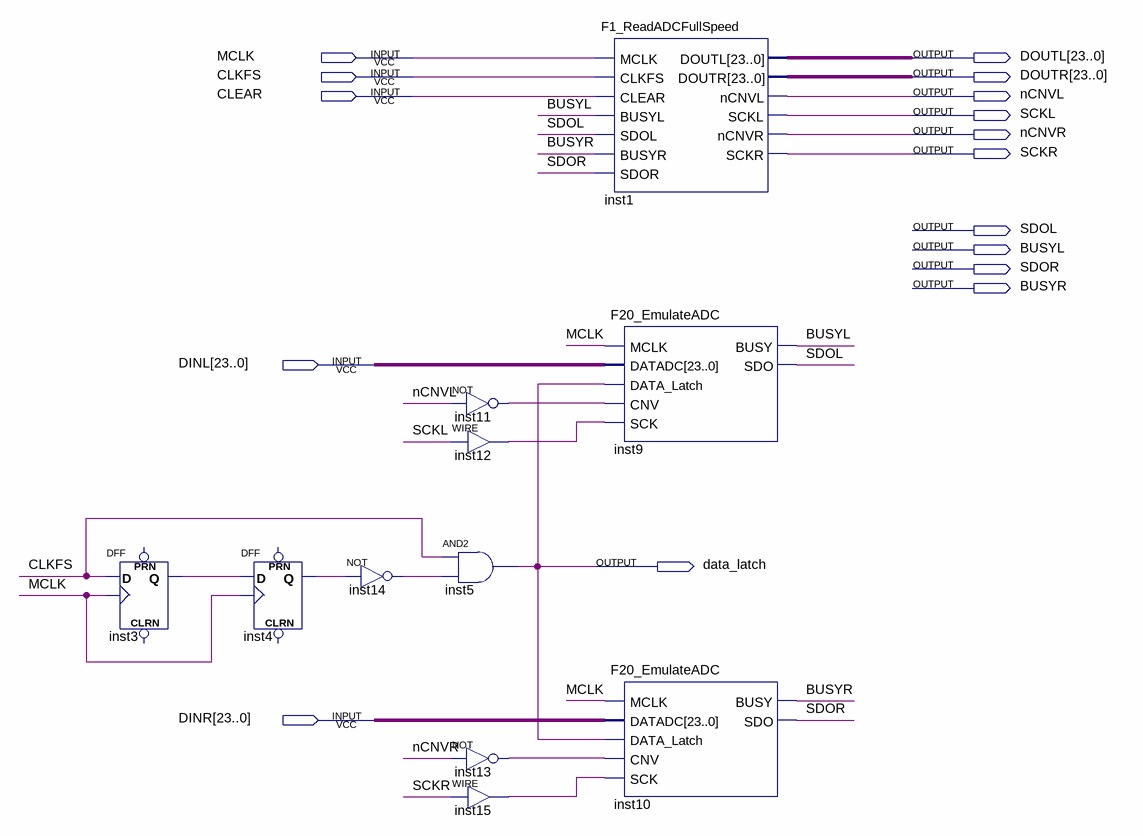
[diagram p0: schematic sheet]
// Quartus schematic TEST_ReadADCfullspeed.bdf as structural Verilog: 11 symbols, 16 pins
module TEST_ReadADCfullspeed (
  input  MCLK,
  input  CLKFS,
  input  CLEAR,
  input  [23:0] DINL,
  input  [23:0] DINR,
  output [23:0] DOUTL,
  output [23:0] DOUTR,
  output nCNVL,
  output SCKL,
  output nCNVR,
  output SCKR,
  output SDOL,
  output BUSYL,
  output SDOR,
  output BUSYR,
  output data_latch
);

  wire inst3_q, inst4_q, inst11_out, inst12_out, inst13_out, inst14_out, inst15_out;

  DFF inst3 (.CLK(MCLK), .D(CLKFS), .Q(inst3_q));  // open: CLRN, PRN
  DFF inst4 (.CLK(MCLK), .D(inst3_q), .Q(inst4_q));  // open: CLRN, PRN
  not inst14 (inst14_out, inst4_q);
  not inst11 (inst11_out, nCNVL);
  assign inst12_out = SCKL;  // WIRE inst12
  and inst5 (data_latch, CLKFS, inst14_out);
  not inst13 (inst13_out, nCNVR);
  assign inst15_out = SCKR;  // WIRE inst15
  F1_ReadADCFullSpeed inst1 (
    .MCLK(MCLK), .CLKFS(CLKFS), .CLEAR(CLEAR), .BUSYL(BUSYL), .SDOL(SDOL), .BUSYR(BUSYR), .SDOR(SDOR),
    .DOUTL(DOUTL), .DOUTR(DOUTR), .nCNVL(nCNVL), .SCKL(SCKL), .nCNVR(nCNVR), .SCKR(SCKR));
  F20_EmulateADC inst9 (
    .MCLK(MCLK), .DATADC(DINL), .DATA_Latch(data_latch), .CNV(inst11_out), .SCK(inst12_out), .BUSY(BUSYL),
    .SDO(SDOL));
  F20_EmulateADC inst10 (
    .MCLK(MCLK), .DATADC(DINR), .DATA_Latch(data_latch), .CNV(inst13_out), .SCK(inst15_out), .BUSY(BUSYR),
    .SDO(SDOR));
endmodule
